# Altium schematic sheet 2_waffling60-SI_matrix.SchDoc: =ProjectTitle
size A3; Address1: github.com/4pplet/waffling60; Address2: Licence: CERN-OHL-S; SheetNumber: 2; SheetTotal: 3
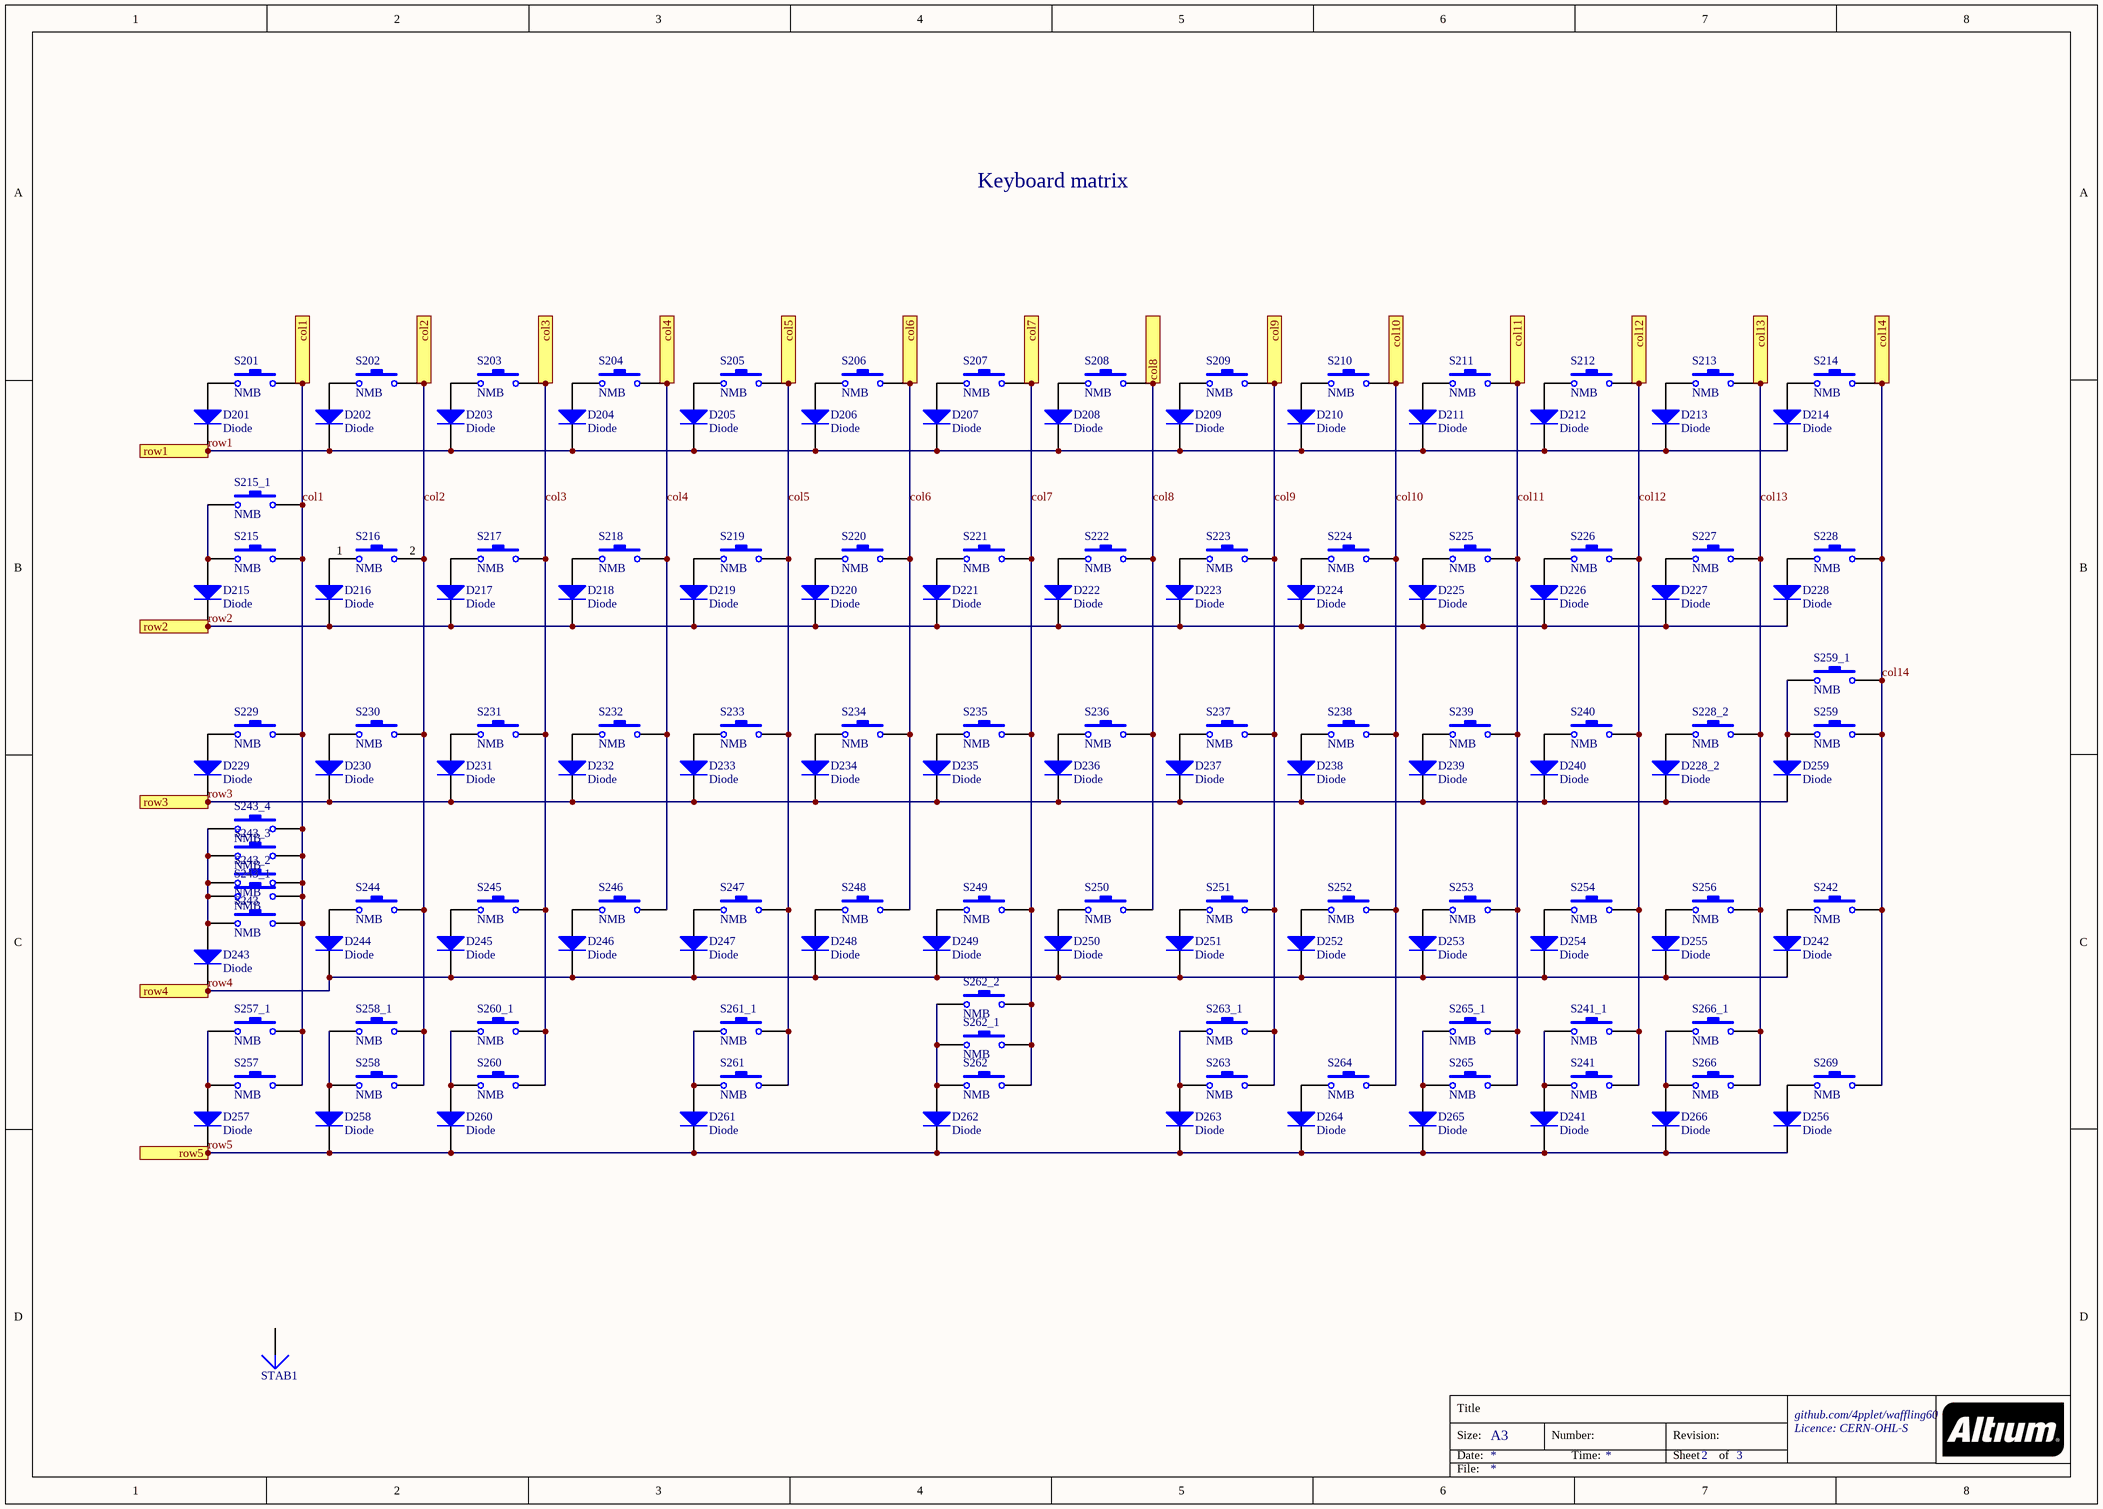
[diagram p0: 2_waffling60-SI_matrix.SchDoc]

## Parts
D201  Diode  [SOD-123]
D202  Diode  [SOD-123]
D203  Diode  [SOD-123]
D204  Diode  [SOD-123]
D205  Diode  [SOD-123]
D206  Diode  [SOD-123]
D207  Diode  [SOD-123]
D208  Diode  [SOD-123]
D209  Diode  [SOD-123]
D210  Diode  [SOD-123]
D211  Diode  [SOD-123]
D212  Diode  [SOD-123]
D213  Diode  [SOD-123]
D214  Diode  [SOD-123]
D215  Diode  [SOD-123]
D216  Diode  [SOD-123]
D217  Diode  [SOD-123]
D218  Diode  [SOD-123]
D219  Diode  [SOD-123]
D220  Diode  [SOD-123]
D221  Diode  [SOD-123]
D222  Diode  [SOD-123]
D223  Diode  [SOD-123]
D224  Diode  [SOD-123]
D225  Diode  [SOD-123]
D226  Diode  [SOD-123]
D227  Diode  [SOD-123]
D228  Diode  [SOD-123]
D228_2  Diode  [SOD-123]
D229  Diode  [SOD-123]
D230  Diode  [SOD-123]
D231  Diode  [SOD-123]
D232  Diode  [SOD-123]
D233  Diode  [SOD-123]
D234  Diode  [SOD-123]
D235  Diode  [SOD-123]
D236  Diode  [SOD-123]
D237  Diode  [SOD-123]
D238  Diode  [SOD-123]
D239  Diode  [SOD-123]
D240  Diode  [SOD-123]
D241  Diode  [SOD-123]
D242  Diode  [SOD-123]
D243  Diode  [SOD-123]
D244  Diode  [SOD-123]
D245  Diode  [SOD-123]
D246  Diode  [SOD-123]
D247  Diode  [SOD-123]
D248  Diode  [SOD-123]
D249  Diode  [SOD-123]
D250  Diode  [SOD-123]
D251  Diode  [SOD-123]
D252  Diode  [SOD-123]
D253  Diode  [SOD-123]
D254  Diode  [SOD-123]
D255  Diode  [SOD-123]
D256  Diode  [SOD-123]
D257  Diode  [SOD-123]
D258  Diode  [SOD-123]
D259  Diode  [SOD-123]
D260  Diode  [SOD-123]
D261  Diode  [SOD-123]
D262  Diode  [SOD-123]
D263  Diode  [SOD-123]
D264  Diode  [SOD-123]
D265  Diode  [SOD-123]
D266  Diode  [SOD-123]
S201  NMB  [NMB-Switch 1U - switched pol  - no allignment pins]  (no BOM)
S202  NMB  [NMB-Switch 1U - no allignment pins]  (no BOM)
S203  NMB  [NMB-Switch 1U - switched pol  - no allignment pins]  (no BOM)
S204  NMB  [NMB-Switch 1U - switched pol  - no allignment pins]  (no BOM)
S205  NMB  [NMB-Switch 1U - switched pol  - no allignment pins]  (no BOM)
S206  NMB  [NMB-Switch 1U - switched pol  - no allignment pins]  (no BOM)
S207  NMB  [NMB-Switch 1U - switched pol  - no allignment pins]  (no BOM)
S208  NMB  [NMB-Switch 1U - switched pol  - no allignment pins]  (no BOM)
S209  NMB  [NMB-Switch 1U - switched pol  - no allignment pins]  (no BOM)
S210  NMB  [NMB-Switch 1U - switched pol  - no allignment pins]  (no BOM)
S211  NMB  [NMB-Switch 1U - switched pol  - no allignment pins]  (no BOM)
S212  NMB  [NMB-Switch 1U - switched pol  - no allignment pins]  (no BOM)
S213  NMB  [NMB-Switch 1U - switched pol  - no allignment pins]  (no BOM)
S214  NMB  [NMB-Switch 1U - no allignment pins]  (no BOM)
S215  NMB  [NMB-Switch 1U - switched pol  - no allignment pins]  (no BOM)
S215_1  NMB  [NMB-Switch 1U - switched pol  - no allignment pins]  (no BOM)
S216  NMB  [NMB-Switch 1U - no allignment pins]  (no BOM)
S217  NMB  [NMB-Switch 1U - switched pol  - no allignment pins]  (no BOM)
S218  NMB  [NMB-Switch 1U - switched pol  - no allignment pins]  (no BOM)
S219  NMB  [NMB-Switch 1U - switched pol  - no allignment pins]  (no BOM)
S220  NMB  [NMB-Switch 1U - no allignment pins]  (no BOM)
S221  NMB  [NMB-Switch 1U - switched pol  - no allignment pins]  (no BOM)
S222  NMB  [NMB-Switch 1U - no allignment pins]  (no BOM)
S223  NMB  [NMB-Switch 1U - switched pol  - no allignment pins]  (no BOM)
S224  NMB  [NMB-Switch 1U - switched pol  - no allignment pins]  (no BOM)
S225  NMB  [NMB-Switch 1U - switched pol  - no allignment pins]  (no BOM)
S226  NMB  [NMB-Switch 1U - no allignment pins]  (no BOM)
S227  NMB  [NMB-Switch 1U - no allignment pins]  (no BOM)
S228  NMB  [NMB-Switch 1U - no allignment pins]  (no BOM)
S228_2  NMB  [NMB-Switch 1U - no allignment pins]  (no BOM)
S229  NMB  [NMB-Switch 1U - no allignment pins]  (no BOM)
S230  NMB  [NMB-Switch 1U - no allignment pins]  (no BOM)
S231  NMB  [NMB-Switch 1U - switched pol  - no allignment pins]  (no BOM)
S232  NMB  [NMB-Switch 1U - switched pol  - no allignment pins]  (no BOM)
S233  NMB  [NMB-Switch 1U - switched pol  - no allignment pins]  (no BOM)
S234  NMB  [NMB-Switch 1U - switched pol  - no allignment pins]  (no BOM)
S235  NMB  [NMB-Switch 1U - switched pol  - no allignment pins]  (no BOM)
S236  NMB  [NMB-Switch 1U - switched pol  - no allignment pins]  (no BOM)
S237  NMB  [NMB-Switch 1U - switched pol  - no allignment pins]  (no BOM)
S238  NMB  [NMB-Switch 1U - switched pol  - no allignment pins]  (no BOM)
S239  NMB  [NMB-Switch 1U - switched pol  - no allignment pins]  (no BOM)
S240  NMB  [NMB-Switch 1U - switched pol  - no allignment pins]  (no BOM)
S241  NMB  [NMB-Switch 1U - no allignment pins]  (no BOM)
S241_1  NMB  [NMB-Switch 1U - no allignment pins]  (no BOM)
S242  NMB  [MX-switch - Enter - Rotated Stab]  (no BOM)
S243  NMB  [MX-switch - Left shift]  (no BOM)
S243_1  NMB  [MX-switch - Left shift]  (no BOM)
S243_2  NMB  [MX-switch - Left shift]  (no BOM)
S243_3  NMB  [MX-switch - Left shift]  (no BOM)
S243_4  NMB  [MX-switch - Left shift]  (no BOM)
S244  NMB  [NMB-Switch 1U - no allignment pins]  (no BOM)
S245  NMB  [NMB-Switch 1U - switched pol  - no allignment pins]  (no BOM)
S246  NMB  [NMB-Switch 1U - switched pol  - no allignment pins]  (no BOM)
S247  NMB  [NMB-Switch 1U - switched pol  - no allignment pins]  (no BOM)
S248  NMB  [NMB-Switch 1U - switched pol  - no allignment pins]  (no BOM)
S249  NMB  [NMB-Switch 1U - switched pol  - no allignment pins]  (no BOM)
S250  NMB  [NMB-Switch 1U - switched pol  - no allignment pins]  (no BOM)
S251  NMB  [NMB-Switch 1U - switched pol  - no allignment pins]  (no BOM)
S252  NMB  [NMB-Switch 1U - switched pol  - no allignment pins]  (no BOM)
S253  NMB  [NMB-Switch 1U - switched pol  - no allignment pins]  (no BOM)
S254  NMB  [NMB-Switch 1U - switched pol  - no allignment pins]  (no BOM)
S256  NMB  [MX-switch - right shift]  (no BOM)
S257  NMB  [NMB-Switch 1U - no allignment pins]  (no BOM)
S257_1  NMB  [NMB-Switch 1U - no allignment pins]  (no BOM)
S258  NMB  [NMB-Switch 1U - no allignment pins]  (no BOM)
S258_1  NMB  [NMB-Switch 1U - no allignment pins]  (no BOM)
S259  NMB  [NMB-Switch 1U - no allignment pins]  (no BOM)
S259_1  NMB  [NMB-Switch 1U - no allignment pins]  (no BOM)
S260  NMB  [NMB-Switch 1U - no allignment pins]  (no BOM)
S260_1  NMB  [NMB-Switch 1U - no allignment pins]  (no BOM)
S261  NMB  [MX-SWITCH - L SPLIT SPACE_V2]  (no BOM)
S261_1  NMB  [MX-switch - 3U - rotated stab]  (no BOM)
S262  NMB  [MX-switch - Space_V3]  (no BOM)
S262_1  NMB  [MX-switch - 3U - rotated stab]  (no BOM)
S262_2  NMB  [MX-switch - 3U - rotated stab]  (no BOM)
S263  NMB  [MX-SWITCH - R SPLIT SPACE_V2]  (no BOM)
S263_1  NMB  [MX-switch - 3U - rotated stab]  (no BOM)
S264  NMB  [NMB-Switch 1U - switched pol  - no allignment pins]  (no BOM)
S265  NMB  [NMB-Switch 1U - no allignment pins]  (no BOM)
S265_1  NMB  [NMB-Switch 1U - no allignment pins]  (no BOM)
S266  NMB  [NMB-Switch 1U - no allignment pins]  (no BOM)
S266_1  NMB  [NMB-Switch 1U - no allignment pins]  (no BOM)
S269  NMB  [NMB-Switch 1U - no allignment pins]  (no BOM)
STAB1  Plug  [Stab 10U]  (value not drawn)  (no BOM)

## Ports
col1, col2, col3, col4, col5, col6, col7, col8, col9, col10, col11, col12, col13, col14, row1, row2, row3, row4, row5

## Nets
col1: S201.2 S215.2 S215_1.2 S229.1 S243.2 S243_1.2 S243_2.2 S243_3.2 S243_4.2 S257.1 S257_1.1 ; port col1
col2: S202.2 S216.2 S230.2 S244.1 S258.2 S258_1.1 ; port col2
col3: S203.2 S217.2 S231.2 S245.2 S260.2 S260_1.1 ; port col3
col4: S204.2 S218.2 S232.2 S246.2 ; port col4
col5: S205.2 S219.2 S233.2 S247.2 S261.2 S261_1.2 ; port col5
col6: S206.2 S220.2 S234.2 S248.2 ; port col6
col7: S207.2 S221.2 S235.2 S249.2 S262.1 S262_1.1 S262_2.1 ; port col7
col8: S208.2 S222.2 S236.2 S250.2 ; port col8
col9: S209.2 S223.2 S237.2 S251.2 S263.1 S263_1.1 ; port col9
col10: S210.2 S224.2 S238.2 S252.2 S264.2 ; port col10
col11: S211.2 S225.2 S239.2 S253.2 S265.1 S265_1.1 ; port col11
col12: S212.2 S226.2 S240.2 S241.1 S241_1.1 S254.2 ; port col12
col13: S213.2 S227.2 S228_2.2 S256.2 S266.2 S266_1.2 ; port col13
col14: S214.2 S228.2 S242.2 S259.1 S259_1.2 S269.2 ; port col14
row1: D201.2(K) D202.2(K) D203.2(K) D204.2(K) D205.2(K) D206.2(K) D207.2(K) D208.2(K) D209.2(K) D210.2(K) D211.2(K) D212.2(K) D213.2(K) D214.2(K) ; port row1
row2: D215.2(K) D216.2(K) D217.2(K) D218.2(K) D219.2(K) D220.2(K) D221.2(K) D222.2(K) D223.2(K) D224.2(K) D225.2(K) D226.2(K) D227.2(K) D228.2(K) ; port row2
row3: D228_2.2(K) D229.2(K) D230.2(K) D231.2(K) D232.2(K) D233.2(K) D234.2(K) D235.2(K) D236.2(K) D237.2(K) D238.2(K) D239.2(K) D240.2(K) D259.2(K) ; port row3
row4: D242.2(K) D243.2(K) D244.2(K) D245.2(K) D246.2(K) D247.2(K) D248.2(K) D249.2(K) D250.2(K) D251.2(K) D252.2(K) D253.2(K) D254.2(K) D255.2(K) ; port row4
row5: D241.2(K) D256.2(K) D257.2(K) D258.2(K) D260.2(K) D261.2(K) D262.2(K) D263.2(K) D264.2(K) D265.2(K) D266.2(K) ; port row5
NetD201_1: D201.1(A) S201.1
NetD202_1: D202.1(A) S202.1
NetD203_1: D203.1(A) S203.1
NetD204_1: D204.1(A) S204.1
NetD205_1: D205.1(A) S205.1
NetD206_1: D206.1(A) S206.1
NetD207_1: D207.1(A) S207.1
NetD208_1: D208.1(A) S208.1
NetD209_1: D209.1(A) S209.1
NetD210_1: D210.1(A) S210.1
NetD211_1: D211.1(A) S211.1
NetD212_1: D212.1(A) S212.1
NetD213_1: D213.1(A) S213.1
NetD214_1: D214.1(A) S214.1
NetD215_1: D215.1(A) S215.1 S215_1.1
NetD216_1: D216.1(A) S216.1
NetD217_1: D217.1(A) S217.1
NetD218_1: D218.1(A) S218.1
NetD219_1: D219.1(A) S219.1
NetD220_1: D220.1(A) S220.1
NetD221_1: D221.1(A) S221.1
NetD222_1: D222.1(A) S222.1
NetD223_1: D223.1(A) S223.1
NetD224_1: D224.1(A) S224.1
NetD225_1: D225.1(A) S225.1
NetD226_1: D226.1(A) S226.1
NetD227_1: D227.1(A) S227.1
NetD228_1: D228.1(A) S228.1
NetD228_2_1: D228_2.1(A) S228_2.1
NetD229_1: D229.1(A) S229.2
NetD230_1: D230.1(A) S230.1
NetD231_1: D231.1(A) S231.1
NetD232_1: D232.1(A) S232.1
NetD233_1: D233.1(A) S233.1
NetD234_1: D234.1(A) S234.1
NetD235_1: D235.1(A) S235.1
NetD236_1: D236.1(A) S236.1
NetD237_1: D237.1(A) S237.1
NetD238_1: D238.1(A) S238.1
NetD239_1: D239.1(A) S239.1
NetD240_1: D240.1(A) S240.1
NetD241_1: D241.1(A) S241.2 S241_1.2
NetD242_1: D242.1(A) S242.1
NetD243_1: D243.1(A) S243.1 S243_1.1 S243_2.1 S243_3.1 S243_4.1
NetD244_1: D244.1(A) S244.2
NetD245_1: D245.1(A) S245.1
NetD246_1: D246.1(A) S246.1
NetD247_1: D247.1(A) S247.1
NetD248_1: D248.1(A) S248.1
NetD249_1: D249.1(A) S249.1
NetD250_1: D250.1(A) S250.1
NetD251_1: D251.1(A) S251.1
NetD252_1: D252.1(A) S252.1
NetD253_1: D253.1(A) S253.1
NetD254_1: D254.1(A) S254.1
NetD255_1: D255.1(A) S256.1
NetD256_1: D256.1(A) S269.1
NetD257_1: D257.1(A) S257.2 S257_1.2
NetD258_1: D258.1(A) S258.1 S258_1.2
NetD259_1: D259.1(A) S259.1 S259_1.1
NetD260_1: D260.1(A) S260.1 S260_1.2
NetD261_1: D261.1(A) S261.1 S261_1.1
NetD262_1: D262.1(A) S262.2 S262_1.2 S262_2.2
NetD263_1: D263.1(A) S263.2 S263_1.2
NetD264_1: D264.1(A) S264.1
NetD265_1: D265.1(A) S265.2 S265_1.2
NetD266_1: D266.1(A) S266.1 S266_1.1

Not connected (* = marked no-connect by the designer): STAB1 1

## Notes on the sheet
- Keyboard matrix
- Title
- Size:
- Date:
- A3
- Number:
- Time:
- Revision:
- Sheet
- of
- File:

## Library data of the parts
D201-D228 D228_2 D229-D266 = Diode: Default Diode; MRF.Part: 1N4148W; LCSC MFG: ST(Semtech); Version: SOD-123; LCSC Part #: C81598
S201-S214 S216-S228 S228_2 S229-S241 S241_1 S242 S243 S243_1-S243_4 S244-S254 S256 S257 S257_1 S258 S258_1 S259 S259_1 S260 S260_1 S261 S261_1 S262 S262_1 S262_2 S263 S263_1 S264 S265 S265_1 S266 S266_1 S269 = SW-PB: Switch
S215 S215_1 = SW-PB: TAB